# EAGLE design pressure (EAGLE 6.4)
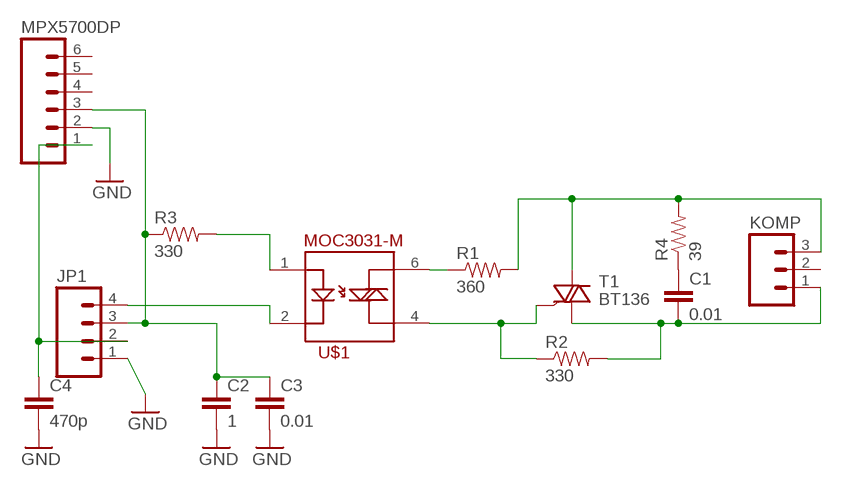
[diagram p0: schematic, sheet 1]

## Parts
C1  0.01  CAPPTH1  [CAP-PTH-5MM]
C2  1  CAPPTH1  [CAP-PTH-5MM]
C3  0.01  CAPPTH1  [CAP-PTH-5MM]
C4  470p  CAPPTH1  [CAP-PTH-5MM]
JP1  M04LONGPADS  [1X04_LONGPADS]
KOMP  M03LONGPADS  [1X03_LONGPADS]
MPX5700DP  M06LONGPADS  [1X06_LONGPADS]
R1  360  RESISTORKIT  [AXIAL-0.3-KIT]
R2  330  RESISTORKIT  [AXIAL-0.3-KIT]
R3  330  RESISTORKIT  [AXIAL-0.3-KIT]
R4  39  RESISTORKIT  [AXIAL-0.3-KIT]
T1  BT136  [TO220AB]
U$1  MOC3031-M  [DIL06]

## Nets
GND: C2.2 C3.2 C4.2 JP1.1 MPX5700DP.2
KOMP: KOMP.3 R1.P$2 R4.P$2 T1.2(A2)
N$1: C1.2 KOMP.1 R2.P$2 T1.1(A1)
N$2: R2.P$1 T1.3(G) U$1.4
N$3: C2.1 C3.1 JP1.3 MPX5700DP.3 R3.P$1
N$4: R3.P$2 U$1.1
N$5: JP1.4 U$1.2
N$6: R1.P$1 U$1.6
N$7: C4.1 JP1.2 MPX5700DP.1
N$9: C1.1 R4.P$1
Unconnected: KOMP.2 MPX5700DP.4 MPX5700DP.5 MPX5700DP.6

## Library data of the parts
C1-C4 = SparkFun-Passives:CAP: Capacitor Standard 0603 ceramic capacitor, and 0.1" leaded capacitor.
JP1 = SparkFun-Connectors:M04: Header 4 Standard 4-pin 0.1" header. Use with straight break away headers (SKU : PRT-00116), right angle break away headers (PRT-00553), swiss pins (PRT-00743), machine pins (PRT-00117), and female headers (PRT-00115). Molex polarized connector foot print use with SKU : PRT-08231 with associated crimp pins and housings. 1MM SMD Version SKU: PRT-10208
KOMP = SparkFun-Connectors:M03: Header 3 Standard 3-pin 0.1" header. Use with straight break away headers (SKU : PRT-00116), right angle break away headers (PRT-00553), swiss pins (PRT-00743), machine pins (PRT-00117), and female headers (PRT-00115). Molex polarized connector foot print use with SKU : PRT-08232 with associated crimp pins and housings.
MPX5700DP = SparkFun-Connectors:M06: Header 6 Standard 6-pin 0.1" header. Use with straight break away headers (SKU : PRT-00116), right angle break away headers (PRT-00553), swiss pins (PRT-00743), machine pins (PRT-00117), and female headers (PRT-00115). Molex polarized connector foot print use with SKU : PRT-08094 with associated crimp pins and housings. NOTES ON THE VARIANTS LOCK and LOCK_LONGPADS... This footprint was designed to help hold the alignment of a through-hole component (i.e. 6-pin header) while soldering it into place. You may notice that each hole has been shifted either up or down by 0.005 of an inch from it's more standard position (which is a perfectly straight line). This slight alteration caused the pins (the squares in the middle) to touch the edges of the holes. Because they are alternating, it causes a "brace" to hold the component in place. 0.005 has proven to be the perfect amount of "off-center" position when using our standard breakaway headers. Although looks a little odd when you look at the bare footprint, once you have a header in there, the alteration is very hard to notice. Also, if you push a header all the way into place, it is covered up entirely on the bottom side. This idea of altering the position of holes to aid alignment will be further integrated into the Sparkfun Library for other footprints. It can help hold any component with 3 or more connection pins.
R1-R4 = SparkFun-Passives:RESISTOR: Resistor Basic schematic elements and footprints for 0603, 1206, and PTH resistors.
T1 = triac:BT136: Triac BT136 series E sensitive gate Source: http://www.nxp.com/acrobat_download/datasheets/BT136_SERIES_E_2.pdf
U$1 = SparkFun-DiscreteSemi:MOC3031-M: Opto-isolated TRIAC

## Board
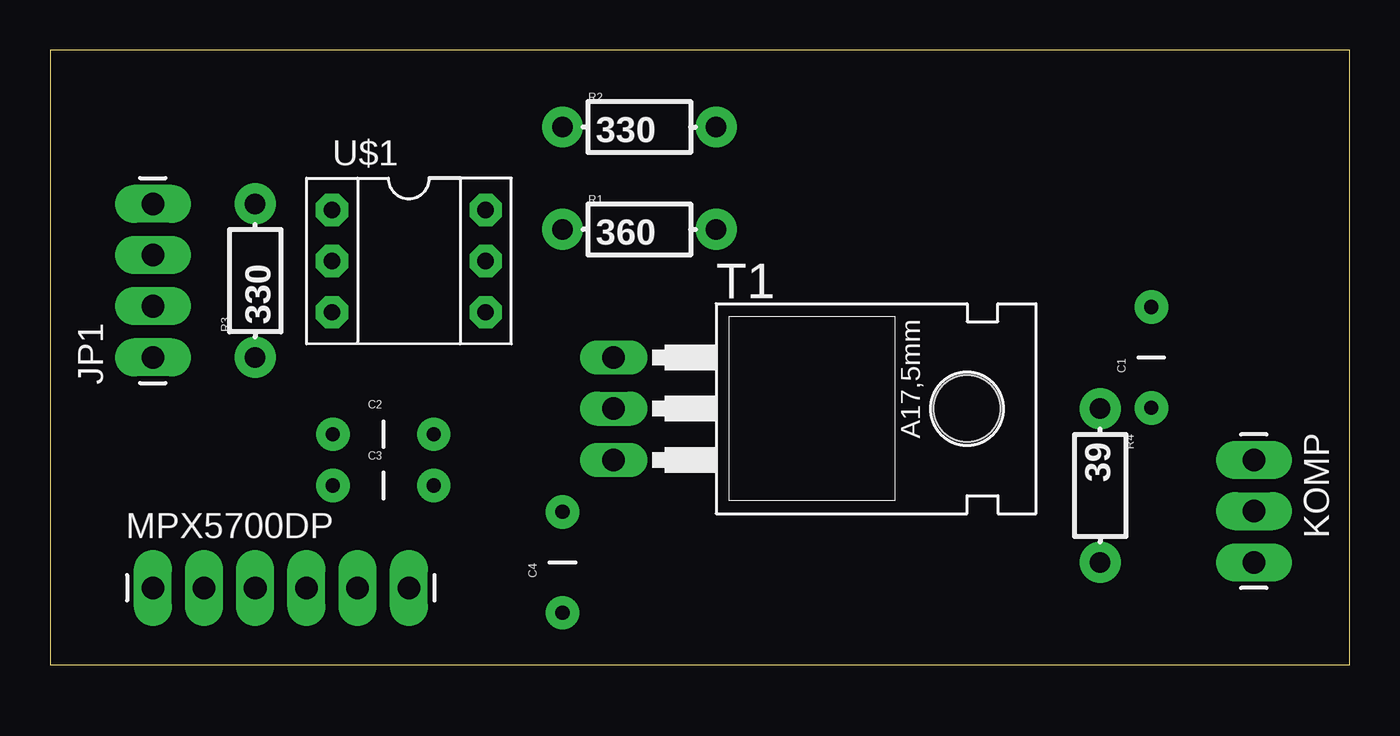
[diagram p1: board, top side]
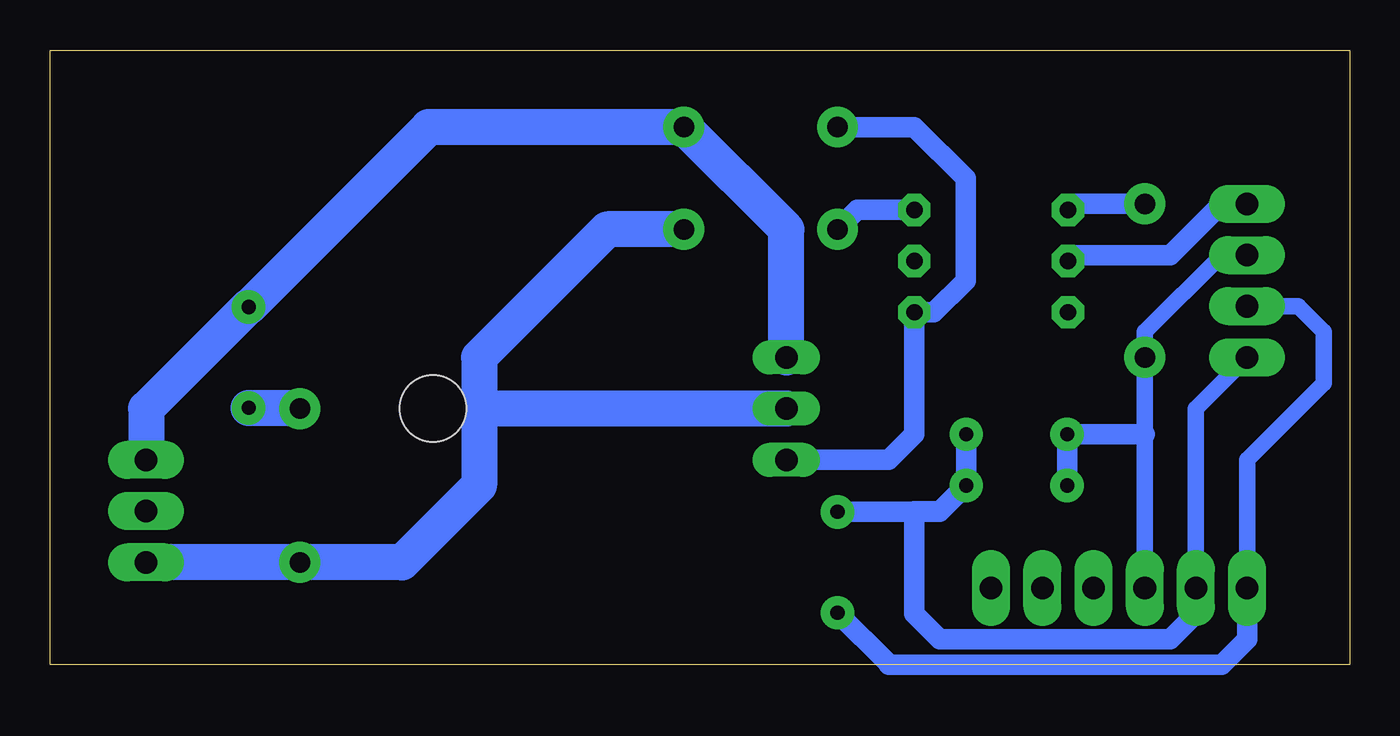
[diagram p2: board, bottom side, seen from below]

Size 64.44 x 30.47 mm. Coordinates in mm from the lower left corner, seen from the top.
Outline: 0,0 64.44,0 64.44,30.47 0,30.47 0,0
Copper layers (1*16): Top 0.035mm / dielectric 1.5mm / Bottom 0.035mm
Design rules "default": minimum track width 10mil, minimum drill 24mil, track to track 8mil, track to pad 8mil, pad to pad 8mil, via to via 8mil, smd to smd 8mil, copper to edge 40mil, drill to drill 8mil, minimum pad ring 10mil, minimum via ring 8mil, stop-mask expansion 4mil, vias tented up to drill 0mil, thermal gap 10mil

### Footprints (pad centres in the part's own frame; a part is rotated, then mirrored left to right if it is on the bottom)
CAP-PTH-5MM = drill 0.7 pad 1.651: 1 -2.5,0; 2 2.5,0
1X04_LONGPADS = drill 1.118 pad 1.88 long: 1 0,0; 2 2.54,0; 3 5.08,0; 4 7.62,0
1X03_LONGPADS = drill 1.118 pad 1.88 long: 1 0,0; 2 2.54,0; 3 5.08,0
1X06_LONGPADS = drill 1.118 pad 1.88 long: 1 0,0; 2 2.54,0; 3 5.08,0; 4 7.62,0; 5 10.16,0; 6 12.7,0
AXIAL-0.3-KIT = drill 1.016 pad 2.032: P$1 -3.81,0; P$2 3.81,0
TO220AB = drill 1.118 long: 1 -2.54,-6.35; 2 0,-6.35; 3 2.54,-6.35 | hole 3.302: 0,11.176
DIL06 = drill 0.813 pad 1.6 octagon: 1 -3.51,-3.81; 2 -0.97,-3.81; 3 1.57,-3.81; 4 1.57,3.81; 5 -0.97,3.81; 6 -3.51,3.81

### Placement (x,y rotation side)
C1  54.61,15.24 90 top
C2  16.51,11.43 0 top
C3  16.51,8.89 0 top
C4  25.4,5.08 90 top
JP1  5.08,15.24 90 top
KOMP  59.69,10.16 270 top
MPX5700DP  5.08,3.81 0 top
R1  29.21,21.59 0 top
R2  29.21,26.67 0 top
R3  10.16,19.05 90 top
R4  52.07,8.89 270 top
T1  34.29,12.7 270 top
U$1  17.78,19.05 270 top

### Tracks (layer width: path | path; a pad name or v marks a point on that pad's centre or on a via)
GND
  Bottom 0.813: JP1.1 7.62,12.7 MPX5700DP.2
  Bottom 1.016: C4.2 20.32,7.58 C3.2 C2.2 19.01,8.93 20.32,7.62 21.59,7.62 21.59,2.54 20.32,1.27 8.89,1.27 7.62,2.54 MPX5700DP.2
KOMP
  Bottom 1.778: R1.P$2 36.83,21.59 43.18,15.24 43.18,12.7 | 43.18,12.7 43.18,8.89 46.99,5.08 R4.P$2 KOMP.3 | T1.2 43.18,12.7
N$1
  Bottom 1.778: T1.1 27.94,21.59 R2.P$2 45.68,26.67 C1.2 54.65,17.74 59.69,12.7 KOMP.1
N$2
  Bottom 1.016: T1.3 22.86,10.16 21.59,11.43 U$1.4 20.62,17.48 19.05,19.05 19.05,24.13 21.59,26.67 R2.P$1
N$3
  Bottom 0.813: MPX5700DP.3 10.16,11.43 R3.P$1 10.16,16.51 6.35,20.32 JP1.3
  Bottom 1.016: C3.1 C2.1 10.16,11.43
N$4
  Bottom 1.016: R3.P$2 13.67,22.86 U$1.1
N$5
  Bottom 1.016: JP1.4 6.35,22.86 8.89,20.32 13.67,20.32 U$1.2
N$6
  Bottom 1.016: U$1.6 24.43,22.56 R1.P$1
N$7
  Bottom 0.813: MPX5700DP.1 5.08,10.16 1.27,13.97 1.27,16.51 2.54,17.78 JP1.2
  Bottom 1.016: MPX5700DP.1 5.08,1.27 6.35,0 22.86,0 22.86,0.04 C4.1
N$9
  Bottom 1.778: C1.1 52.11,12.74 R4.P$1